# Altium project NodoWifi.PrjPcb
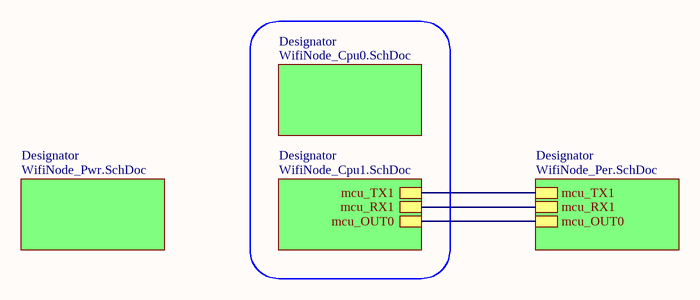
[diagram p0: WifiNode_Blk.SchDoc]
5 sheets, 52 parts. Net scope: hierarchical (ports join the sheet entries above them; power ports are global).
Board files: WifiNode.PcbDoc, WifiNodePanel.PcbDoc
Sheets:
  WifiNode_Blk.SchDoc
    Designator = WifiNode_Cpu0.SchDoc
    Designator = WifiNode_Cpu1.SchDoc
    Designator = WifiNode_Per.SchDoc
    Designator = WifiNode_Pwr.SchDoc

## Sheet WifiNode_Blk.SchDoc: Blk
size A4; Author: Tobias Bavasso Piizzi; Revision: 1; SheetNumber: 1; SheetTotal: 5

### Sub-sheets
Designator = WifiNode_Cpu0.SchDoc: no entries
Designator = WifiNode_Cpu1.SchDoc: mcu_TX1, mcu_RX1, mcu_OUT0
Designator = WifiNode_Per.SchDoc: mcu_TX1, mcu_RX1, mcu_OUT0
Designator = WifiNode_Pwr.SchDoc: no entries

### Nets
mcu_OUT0: sheet Designator/mcu_OUT0, sheet Designator/mcu_OUT0
mcu_RX1: sheet Designator/mcu_RX1, sheet Designator/mcu_RX1
mcu_TX1: sheet Designator/mcu_TX1, sheet Designator/mcu_TX1

### Notes on the sheet
- Title:
- Size:
- Author:
- A4
- Sheet
- of
- Revision:
- File:
- Date:

## Sheet WifiNode_Cpu0.SchDoc: CPU 0
size A4; Author: Tobias Bavasso Piizzi; Revision: 1; SheetNumber: 3; SheetTotal: 5
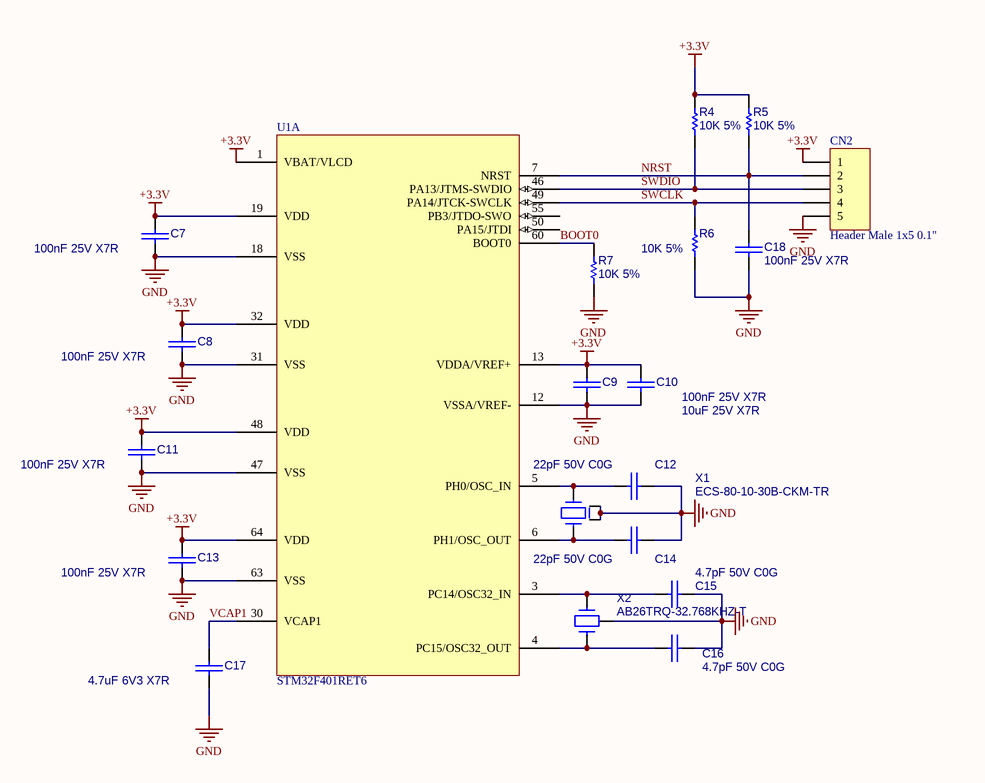
[diagram p1: WifiNode_Cpu0.SchDoc]

### Parts
C7  100nF 25V X7R  [C_0805]
C8  100nF 25V X7R  [C_0805]
C9  100nF 25V X7R  [C_0805]
C10  10uF 25V X7R  [C_0805]
C11  100nF 25V X7R  [C_0805]
C12  22pF 50V C0G  [C_0805]
C13  100nF 25V X7R  [C_0805]
C14  22pF 50V C0G  [C_0805]
C15  4.7pF 50V C0G  [C_0805]
C16  4.7pF 50V C0G  [C_0805]
C17  4.7uF 6V3 X7R  [C_0805]
C18  100nF 25V X7R  [C_0805]
CN2  Header Male 1x5 0.1"  [Header_M_1x5_0.1"]
R4  10K 5%  [R_0805]
R5  10K 5%  [R_0805]
R6  10K 5%  [R_0805]
R7  10K 5%  [R_0805]
U1  STM32F401RET6  (part A of 2)
X1  ECS-80-10-30B-CKM-TR  [ABM3C]
X2  AB26TRQ-32.768KHZ-T  [AB26TQF]

### Nets
+3.3V: C7.1 C8.1 C9.1 C10.1 C11.1 C13.1 CN2.1 R4.2 R5.2 U1.1(VBAT/VLCD) U1.13(VDDA/VREF+) U1.19(VDD) U1.32(VDD) U1.48(VDD) U1.64(VDD)
GND: C7.2 C8.2 C9.2 C10.2 C11.2 C12.2 C13.2 C14.2 C15.2 C16.2 C17.2 C18.2 CN2.5 R6.1 R7.1 U1.12(VSSA/VREF-) U1.18(VSS) U1.31(VSS) U1.47(VSS) U1.63(VSS) X1.2 X1.4 X2.3
BOOT0: R7.2 U1.60(BOOT0)
NRST: C18.1 CN2.2 R5.1 U1.7(NRST)
SWCLK: CN2.4 R6.2 U1.49(PA14/JTCK-SWCLK)
SWDIO: CN2.3 R4.1 U1.46(PA13/JTMS-SWDIO)
VCAP1: C17.1 U1.30(VCAP1)
NetC12_1: C12.1 U1.5(PH0/OSC_IN) X1.1
NetC14_1: C14.1 U1.6(PH1/OSC_OUT) X1.3
NetC15_1: C15.1 U1.3(PC14/OSC32_IN) X2.1
NetC16_1: C16.1 U1.4(PC15/OSC32_OUT) X2.2

Not connected (* = marked no-connect by the designer): U1 50(PA15/JTDI) 55(PB3/JTDO-SWO)

### Notes on the sheet
- Title:
- Size:
- Author:
- A4
- Sheet
- of
- Revision:
- File:
- Date:

### Library data of the parts
C7-C18 = CAP: Non Polarized Capacitor
CN2 = CONN_05P: Connector Generic 5 Vias
R4-R7 = Res1: Resistor
U1 = STM32F401RE: Microcontroller
X1 = CRYSTAL_4P: Crystal 4 Vias + GND
X2 = CRYSTAL 3P: Crystal 2 Vias + GND

## Sheet WifiNode_Cpu1.SchDoc: CPU 1
size A4; Author: Tobias Bavasso Piizzi; Revision: 1; SheetNumber: 4; SheetTotal: 5
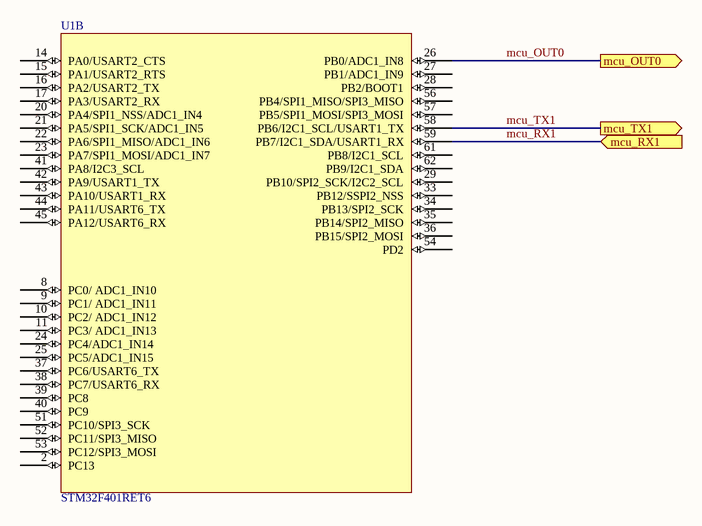
[diagram p2: WifiNode_Cpu1.SchDoc]

### Parts
U1  STM32F401RET6  [LQFP_64]  (part B of 2)

### Ports
mcu_OUT0 (out), mcu_RX1 (in), mcu_TX1 (out)

### Nets
mcu_OUT0: U1.26(PB0/ADC1_IN8) ; port mcu_OUT0
mcu_RX1: U1.59(PB7/I2C1_SDA/USART1_RX) ; port mcu_RX1
mcu_TX1: U1.58(PB6/I2C1_SCL/USART1_TX) ; port mcu_TX1

Not connected (* = marked no-connect by the designer): U1 2(PC13) 8(PC0/_ADC1_IN10) 9(PC1/_ADC1_IN11) 10(PC2/_ADC1_IN12) 11(PC3/_ADC1_IN13) 14(PA0/USART2_CTS) 15(PA1/USART2_RTS) 16(PA2/USART2_TX) 17(PA3/USART2_RX) 20(PA4/SPI1_NSS/ADC1_IN4) 21(PA5/SPI1_SCK/ADC1_IN5) 22(PA6/SPI1_MISO/ADC1_IN6) 23(PA7/SPI1_MOSI/ADC1_IN7) 24(PC4/ADC1_IN14) 25(PC5/ADC1_IN15) 27(PB1/ADC1_IN9) 28(PB2/BOOT1) 29(PB10/SPI2_SCK/I2C2_SCL) 33(PB12/SSPI2_NSS) 34(PB13/SPI2_SCK) 35(PB14/SPI2_MISO) 36(PB15/SPI2_MOSI) 37(PC6/USART6_TX) 38(PC7/USART6_RX) 39(PC8) 40(PC9) 41(PA8/I2C3_SCL) 42(PA9/USART1_TX) 43(PA10/USART1_RX) 44(PA11/USART6_TX) 45(PA12/USART6_RX) 51(PC10/SPI3_SCK) 52(PC11/SPI3_MISO) 53(PC12/SPI3_MOSI) 54(PD2) 56(PB4/SPI1_MISO/SPI3_MISO) 57(PB5/SPI1_MOSI/SPI3_MOSI) 61(PB8/I2C1_SCL) 62(PB9/I2C1_SDA)

### Notes on the sheet
- Title:
- Size:
- Author:
- A4
- Sheet
- of
- Revision:
- File:
- Date:

### Library data of the parts
U1 = STM32F401RE

## Sheet WifiNode_Per.SchDoc: Per
size A4; Author: Tobias Bavasso Piizzi; Revision: 1; SheetNumber: 5; SheetTotal: 5
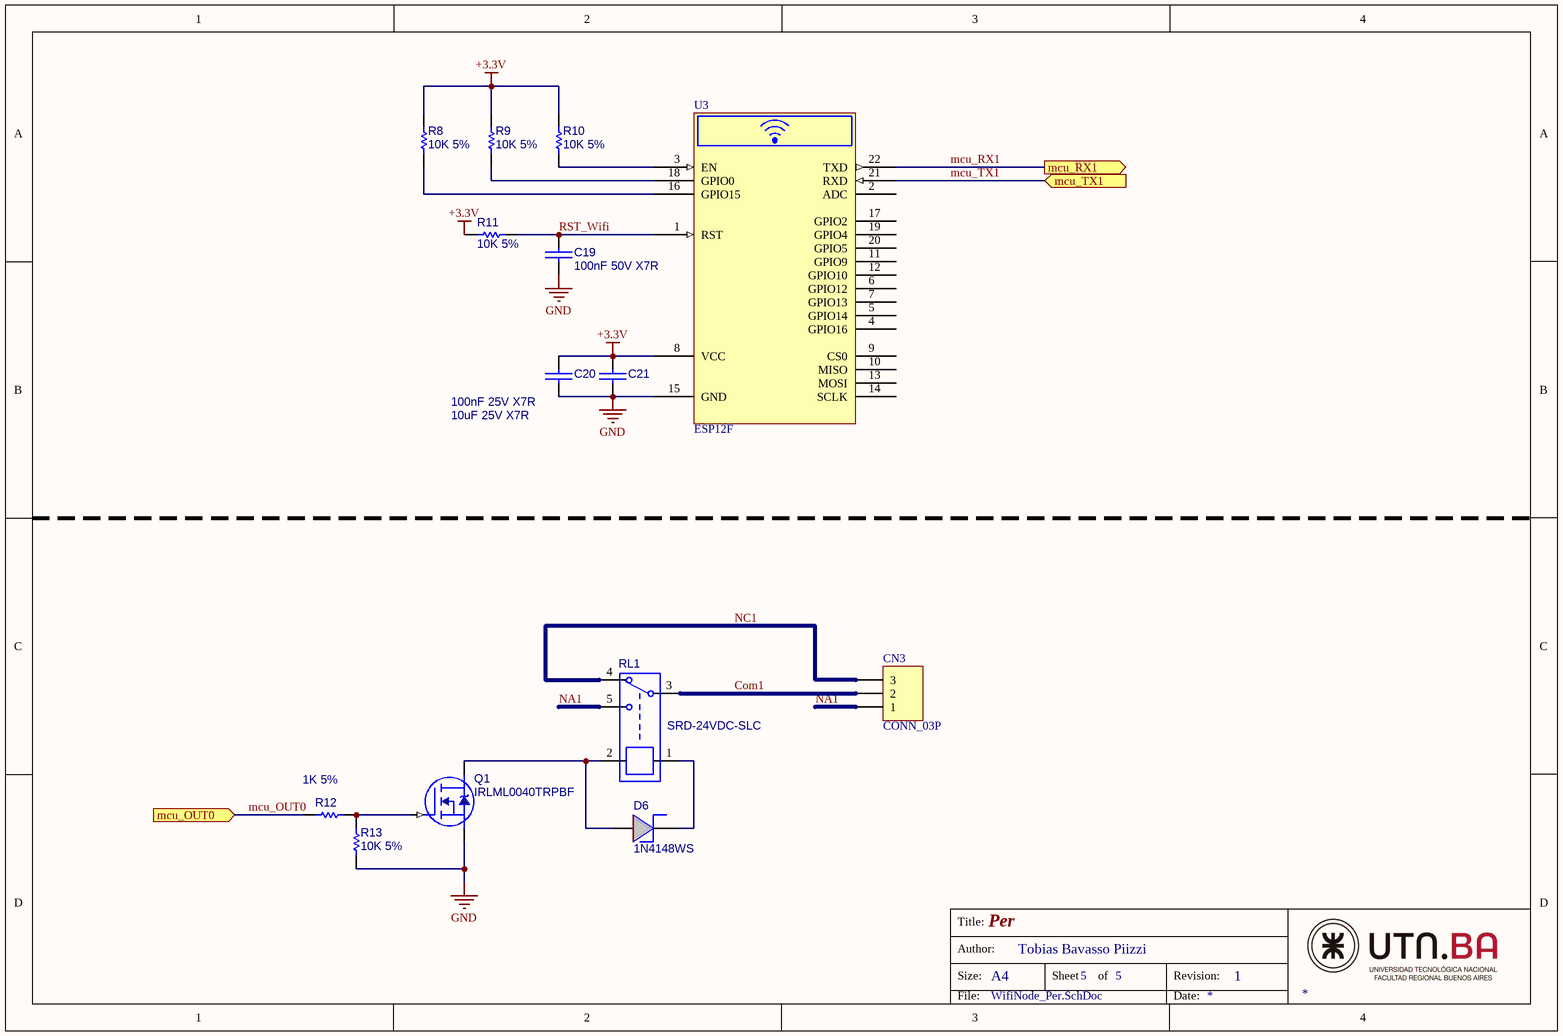
[diagram p3: WifiNode_Per.SchDoc]

### Parts
C19  100nF 50V X7R  [C_0805]
C20  100nF 25V X7R  [C_0805]
C21  10uF 25V X7R  [C_0805]
CN3  CONN_03P  [TerminalBlock_1x3_P5mm]
D6  1N4148WS  [D_SMA]
Q1  IRLML0040TRPBF  [SOT_23]
R8  10K 5%  [R_0805]
R9  10K 5%  [R_0805]
R10  10K 5%  [R_0805]
R11  10K 5%  [R_0805]
R12  1K 5%  [R_0805]
R13  10K 5%  [R_0805]
RL1  SRD-24VDC-SLC  [943-1C]
U3  ESP12F  [ESP12F]

### Ports
mcu_OUT0 (in), mcu_RX1 (out), mcu_TX1 (in)

### Nets
+3.3V: C20.1 C21.1 R8.2 R9.2 R10.2 R11.1 U3.8(VCC)
GND: C19.2 C20.2 C21.2 Q1.2(SOURCE) R13.1 U3.15(GND)
Com1: CN3.2 RL1.3
mcu_OUT0: R12.2 ; port mcu_OUT0
mcu_RX1: U3.22(TXD) ; port mcu_RX1
mcu_TX1: U3.21(RXD) ; port mcu_TX1
NA1: CN3.1 RL1.5
NC1: CN3.3 RL1.4
RST_Wifi: C19.1 R11.2 U3.1(RST)
NetD6_1: D6.1(A) Q1.3(DRAIN) RL1.2
NetD6_2: D6.2(K) RL1.1
NetQ1_1: Q1.1(GATE) R12.1 R13.2
NetR8_1: R8.1 U3.16(GPIO15)
NetR9_1: R9.1 U3.18(GPIO0)
NetR10_1: R10.1 U3.3(EN)

Not connected (* = marked no-connect by the designer): U3 2(ADC) 4(GPIO16) 5(GPIO14) 6(GPIO12) 7(GPIO13) 9(CS0) 10(MISO) 11(GPIO9) 12(GPIO10) 13(MOSI) 14(SCLK) 17(GPIO2) 19(GPIO4) 20(GPIO5)

### Notes on the sheet
- Title:
- Size:
- Author:
- A4
- Sheet
- of
- Revision:
- File:
- Date:

### Library data of the parts
C19-C21 = CAP: Non Polarized Capacitor
CN3 = CONN_03P: Connector Generic 3 Vias
D6 = DIODO_SH: Diode Shottky
Q1 = N_MOSFET_SOT23: Mosfet N-Ch
R8-R13 = Res1: Resistor
RL1 = RELAY SPDT
U3 = ESP12F Wifi Module: Wifi Module

## Sheet WifiNode_Pwr.SchDoc: Power
size A4; Author: Tobias Bavasso Piizzi; Revision: 1; SheetNumber: 2; SheetTotal: 5
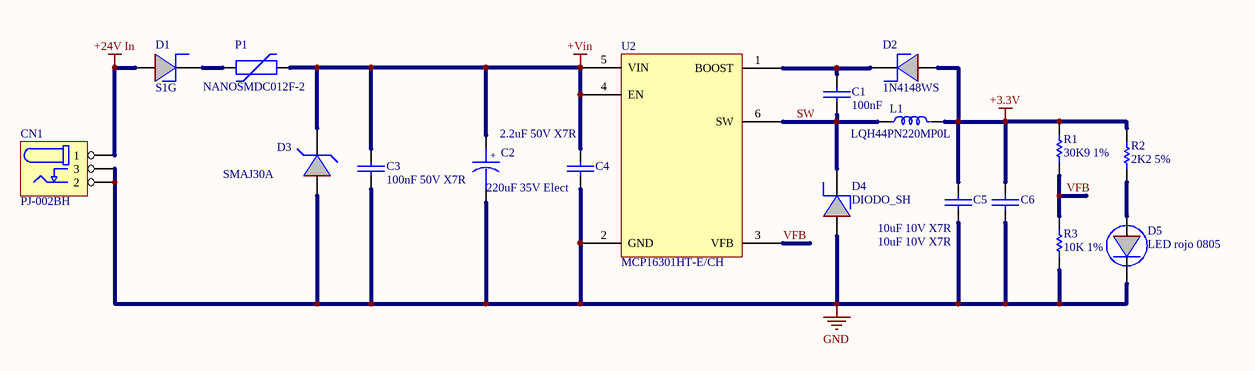
[diagram p4: WifiNode_Pwr.SchDoc]

### Parts
C1  100nF  [C_0805]
C2  220uF 35V Elect  [C_RAD_0.135_H_8X12_S]
C3  100nF 50V X7R  [C_0805]
C4  2.2uF 50V X7R  [C_0805]
C5  10uF 10V X7R  [C_0805]
C6  10uF 10V X7R  [C_0805]
CN1  PJ-002BH  [PJ002B]
D1  S1G  [D_SMA]
D2  1N4148WS  [D_SMA]
D3  SMAJ30A  [D_SMA]
D4  DIODO_SH  [D_SMA]
D5  LED rojo 0805  [D_0805]
L1  LQH44PN220MP0L  [LQH44]
P1  NANOSMDC012F-2  [NANOSMDC]
R1  30K9 1%  [R_0805]
R2  2K2 5%  [R_0805]
R3  10K 1%  [R_0805]
U2  MCP16301HT-E/CH  [SOT23-6]

### Nets
+3.3V: C5.1 C6.1 D2.1(A) L1.2 R1.2 R2.2
+24V In: CN1.1 D1.1(A)
+Vin: C2.1 C3.1 C4.1 D3.2(K) P1.2 U2.4(EN) U2.5(VIN)
GND: C2.2 C3.2 C4.2 C5.2 C6.2 CN1.2 CN1.3 D3.1(A) D4.1(A) D5.2(K) R3.1 U2.2(GND)
SW: C1.2 D4.2(K) L1.1 U2.6(SW)
VFB: R1.1 R3.2 U2.3(VFB)
NetC1_1: C1.1 D2.2(K) U2.1(BOOST)
NetD1_2: D1.2(K) P1.1
NetD5_1: D5.1(A) R2.1

### Notes on the sheet
- Title:
- Size:
- Author:
- A4
- Sheet
- of
- Revision:
- File:
- Date:
- (in symbol CAP_P) +

### Library data of the parts
C1 C3-C6 = CAP: Non Polarized Capacitor
C2 = CAP_P: Polarized Capacitor
CN1 = CN_PowerJack: Barrel Power Connector
D1 D2 D4 = DIODO_SH: Diode Shottky
D3 = DIODE_TVS: Unidirectional TVS
D5 = LED
L1 = IND: Inductor
P1 = PLYSW: Polyswitch
R1-R3 = Res1: Resistor
U2 = MCP16301: Buck 36V-adj 600mA SOT-6

## Nets that join several sheets
+3.3V: WifiNode_Cpu0 (15 pins), WifiNode_Per (7 pins), WifiNode_Pwr (6 pins)
GND: WifiNode_Cpu0 (23 pins), WifiNode_Per (6 pins), WifiNode_Pwr (12 pins)
mcu_OUT0: WifiNode_Cpu1 (U1.26), WifiNode_Per (R12.2)
mcu_RX1: WifiNode_Cpu1 (U1.59), WifiNode_Per (U3.22)
mcu_TX1: WifiNode_Cpu1 (U1.58), WifiNode_Per (U3.21)